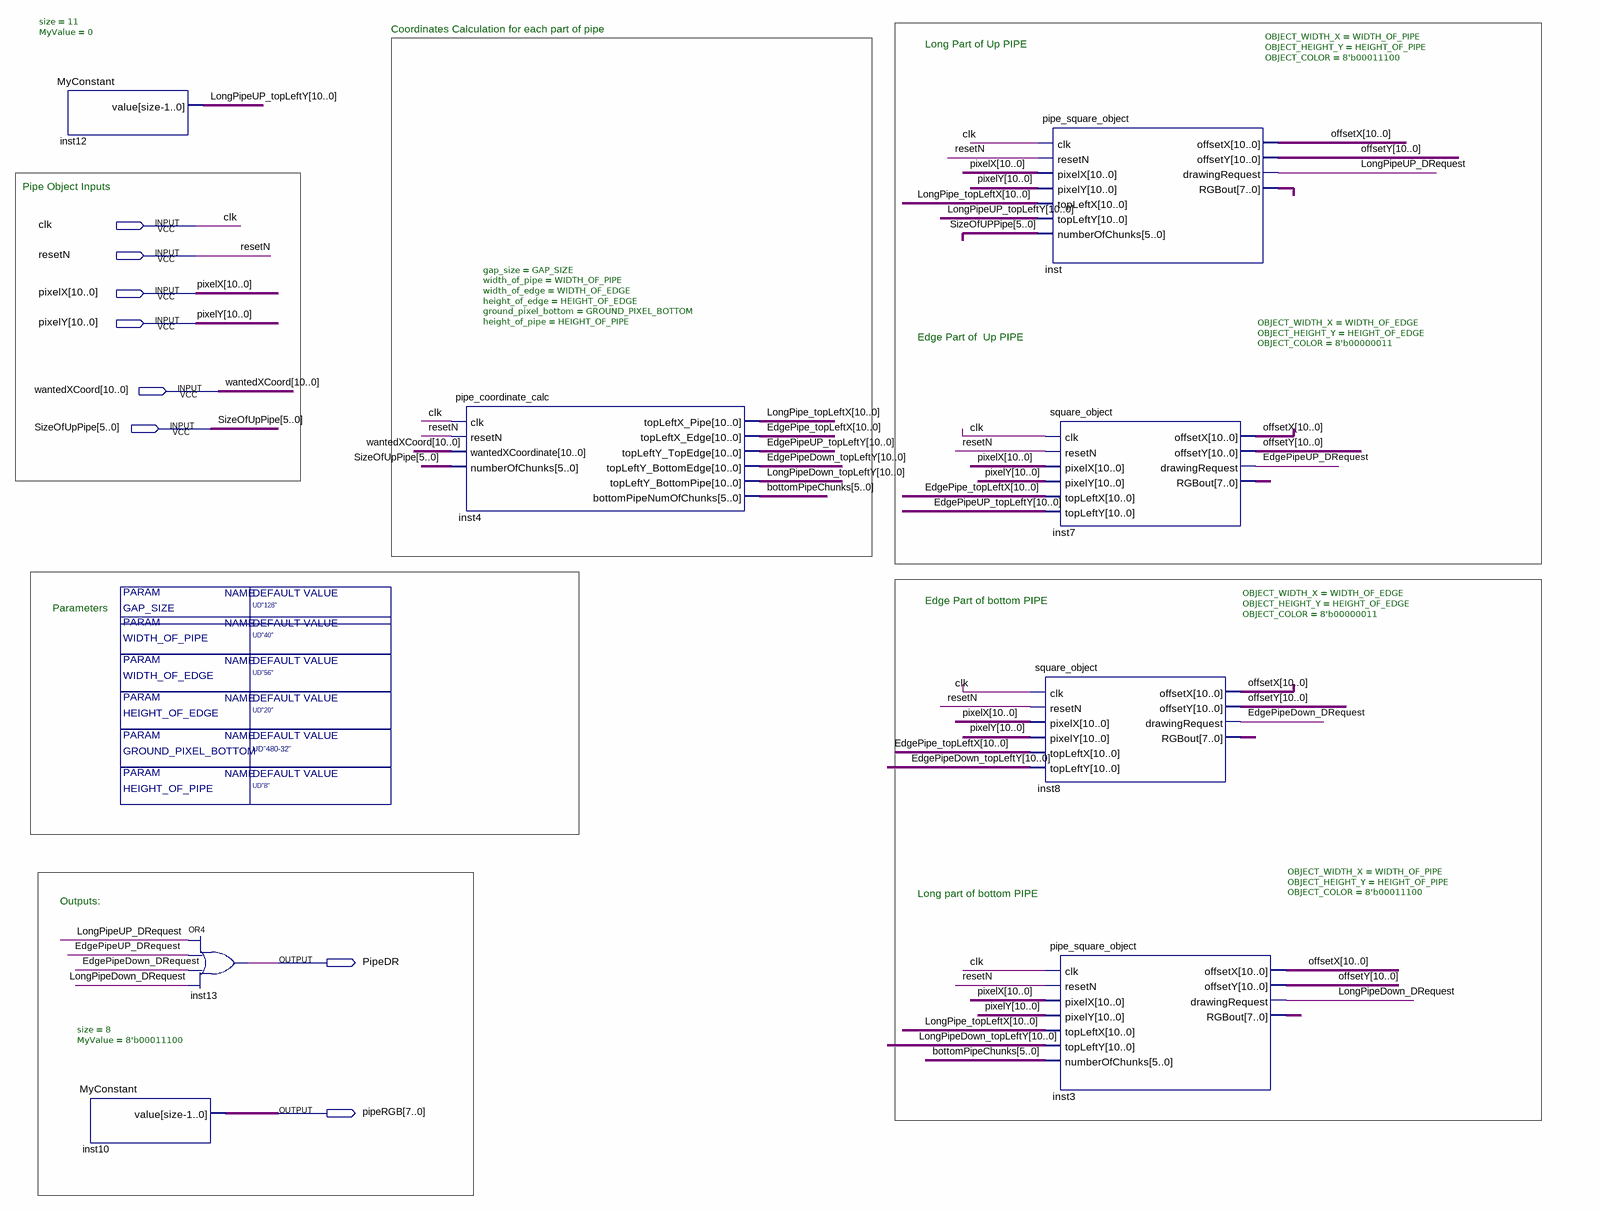
[diagram p0: schematic sheet]
// Quartus schematic Pipe_Object.bdf as structural Verilog: 8 symbols, 8 pins
module Pipe_Object #(parameter HEIGHT_OF_EDGE = "UD\"20\"", parameter GROUND_PIXEL_BOTTOM = "UD\"480-32\"", parameter HEIGHT_OF_PIPE = "UD\"8\"", parameter WIDTH_OF_PIPE = "UD\"40\"", parameter WIDTH_OF_EDGE = "UD\"56\"", parameter GAP_SIZE = "UD\"128\"") (
  input  clk,
  input  resetN,
  input  [10:0] pixelX,
  input  [10:0] pixelY,
  input  [10:0] wantedXCoord,
  input  [5:0] SizeOfUpPipe,
  output PipeDR,
  output [7:0] pipeRGB
);

  wire EdgePipeDown_DRequest, EdgePipeUP_DRequest, LongPipeDown_DRequest, LongPipeUP_DRequest;
  wire [5:0] bottomPipeChunks;
  wire [7:0] inst3_rgbout, inst7_rgbout, inst8_rgbout, inst_rgbout;
  wire [10:0] EdgePipe_topLeftX, EdgePipeDown_topLeftY, EdgePipeUP_topLeftY, LongPipe_topLeftX,
       LongPipeDown_topLeftY, LongPipeUP_topLeftY, offsetX, offsetY;

  MyConstant #(.size(11), .MyValue(0)) inst12 (.value(LongPipeUP_topLeftY));
  MyConstant #(.size(8), .MyValue(8'b00011100)) inst10 (.value(pipeRGB));
  or inst13 (PipeDR, LongPipeUP_DRequest, EdgePipeUP_DRequest, EdgePipeDown_DRequest, LongPipeDown_DRequest);
  pipe_coordinate_calc #(.gap_size(GAP_SIZE), .width_of_pipe(WIDTH_OF_PIPE), .width_of_edge(WIDTH_OF_EDGE), .height_of_edge(HEIGHT_OF_EDGE), .ground_pixel_bottom(GROUND_PIXEL_BOTTOM), .height_of_pipe(HEIGHT_OF_PIPE)) inst4 (
    .clk(clk), .resetN(resetN), .wantedXCoordinate(wantedXCoord), .numberOfChunks(SizeOfUpPipe),
    .topLeftX_Pipe(LongPipe_topLeftX), .topLeftX_Edge(EdgePipe_topLeftX),
    .topLeftY_TopEdge(EdgePipeUP_topLeftY), .topLeftY_BottomEdge(EdgePipeDown_topLeftY),
    .topLeftY_BottomPipe(LongPipeDown_topLeftY), .bottomPipeNumOfChunks(bottomPipeChunks));
  pipe_square_object #(.OBJECT_WIDTH_X(WIDTH_OF_PIPE), .OBJECT_HEIGHT_Y(HEIGHT_OF_PIPE), .OBJECT_COLOR(8'b00011100)) inst (
    .clk(clk), .resetN(resetN), .pixelX(pixelX), .pixelY(pixelY), .topLeftX(LongPipe_topLeftX),
    .topLeftY(LongPipeUP_topLeftY), .numberOfChunks(SizeOfUpPipe), .offsetX(offsetX), .offsetY(offsetY),
    .drawingRequest(LongPipeUP_DRequest), .RGBout(inst_rgbout));
  square_object #(.OBJECT_WIDTH_X(WIDTH_OF_EDGE), .OBJECT_HEIGHT_Y(HEIGHT_OF_EDGE), .OBJECT_COLOR(8'b00000011)) inst7 (
    .clk(clk), .resetN(resetN), .pixelX(pixelX), .pixelY(pixelY), .topLeftX(EdgePipe_topLeftX),
    .topLeftY(EdgePipeUP_topLeftY), .offsetX(offsetX), .offsetY(offsetY),
    .drawingRequest(EdgePipeUP_DRequest), .RGBout(inst7_rgbout));
  square_object #(.OBJECT_WIDTH_X(WIDTH_OF_EDGE), .OBJECT_HEIGHT_Y(HEIGHT_OF_EDGE), .OBJECT_COLOR(8'b00000011)) inst8 (
    .clk(clk), .resetN(resetN), .pixelX(pixelX), .pixelY(pixelY), .topLeftX(EdgePipe_topLeftX),
    .topLeftY(EdgePipeDown_topLeftY), .offsetX(offsetX), .offsetY(offsetY),
    .drawingRequest(EdgePipeDown_DRequest), .RGBout(inst8_rgbout));
  pipe_square_object #(.OBJECT_WIDTH_X(WIDTH_OF_PIPE), .OBJECT_HEIGHT_Y(HEIGHT_OF_PIPE), .OBJECT_COLOR(8'b00011100)) inst3 (
    .clk(clk), .resetN(resetN), .pixelX(pixelX), .pixelY(pixelY), .topLeftX(LongPipe_topLeftX),
    .topLeftY(LongPipeDown_topLeftY), .numberOfChunks(bottomPipeChunks), .offsetX(offsetX),
    .offsetY(offsetY), .drawingRequest(LongPipeDown_DRequest), .RGBout(inst3_rgbout));

  // Notes on the sheet:
  //   Coordinates Calculation for each part of pipe
  //   Long Part of Up PIPE
  //   Pipe Object Inputs
  //   Edge Part of  Up PIPE
  //   Edge Part of bottom PIPE
  //   Parameters
  //   Long part of bottom PIPE
  //   Outputs:
endmodule
